# Altium project FFD.PrjPcb
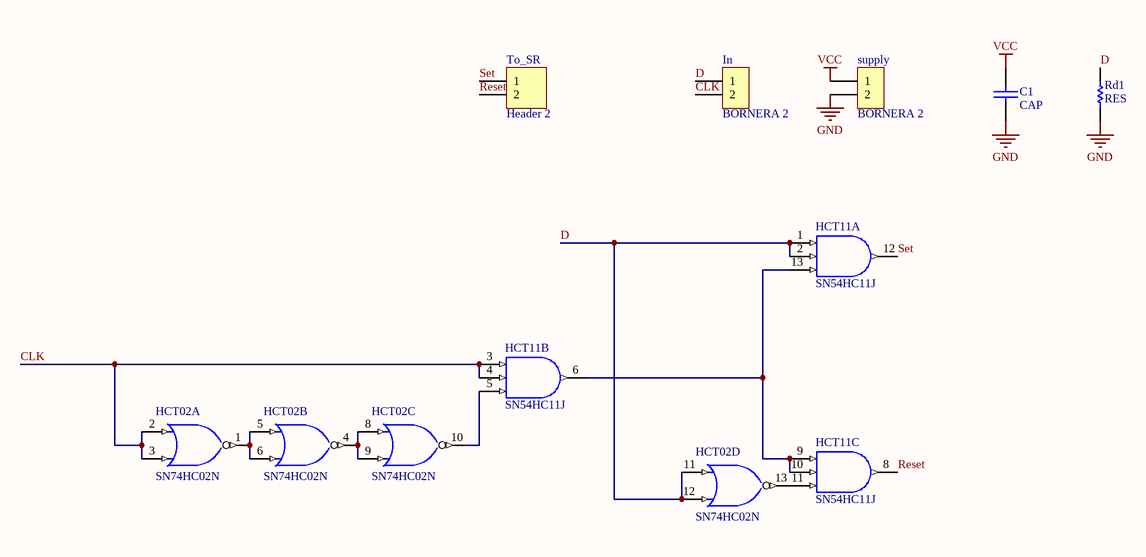
[diagram p0: FFD.SchDoc]
1 sheet, 7 parts. Net scope: global (net labels, ports and power ports of the same name join across sheets).
Board file: FFD.PcbDoc

## Sheet FFD.SchDoc
size A4

### Parts
C1  CAP  [CAP100]
HCT02  SN74HC02N  [N014]  (parts A,B,C,D of 4)
HCT11  SN54HC11J  [J014]  (parts A,B,C of 3)
In  BORNERA 2  [BORNERA2]
Rd1  RES  [0805]
supply  BORNERA 2  [BORNERA2]
To_SR  Header 2  [HDR1X2]

### Nets
GND: C1.2 HCT02.7(GND) HCT11.7(GND) Rd1.1 supply.2
VCC: C1.1 HCT02.14(VCC) HCT11.14(VCC) supply.1
CLK: HCT02.2(A) HCT02.3(B) HCT11.3(A) HCT11.4(B) In.2
D: HCT02.11(A) HCT02.12(B) HCT11.1(A) HCT11.2(B) In.1 Rd1.2
Reset: HCT11.8(Y) To_SR.2
Set: HCT11.12(Y) To_SR.1
NetHCT02_1: HCT02.1(Y) HCT02.5(A) HCT02.6(B)
NetHCT02_4: HCT02.4(Y) HCT02.8(A) HCT02.9(B)
NetHCT02_10: HCT02.10(Y) HCT11.5(C)
NetHCT02_13: HCT02.13(Y) HCT11.11(C)
NetHCT11_6: HCT11.6(Y) HCT11.9(A) HCT11.10(B) HCT11.13(C)

### Library data of the parts
HCT02 = SN74HC02N: Quadruple 2-Input Positive-NOR Gate; Published: 8-Jun-2000; LatestRevisionDate: 04-Mar-2005; LatestRevisionNote: Stylized 3D Model Added.; DatasheetVersion: May-1997; PackageVersion: Oct-1995; PackageReference: N014; Publisher: Altium Limited; PackageDescription: DIP; 14 Leads; Row Spacing 7.62 mm; Pitch 2.54 mm; ComponentLink1Description: Manufacturer Link; ComponentLink1URL: http://www.ti.com/; ComponentLink2Description: Datasheet; ComponentLink2URL: http://www-s.ti.com/sc/ds/sn74hc02.pdf
HCT11 = SN54HC11J: Triple 3-Input Positive-AND Gate; Published: 8-Jun-2000; LatestRevisionDate: 04-Mar-2005; LatestRevisionNote: Stylized 3D Model Added.; DatasheetVersion: May-1997; PackageVersion: Jun-1999; PackageReference: J014; Publisher: Altium Limited; PackageDescription: DIP; 14 Leads; Row Spacing 7.62 mm; Pitch 2.54 mm; ComponentLink1Description: Manufacturer Link; ComponentLink1URL: http://www.ti.com/; ComponentLink2Description: Datasheet; ComponentLink2URL: http://www-s.ti.com/sc/ds/sn54hc11.pdf; ComponentLink3Description: Packaging Specification; ComponentLink3URL: http://focus.ti.com/lit/ml/mcer002d/mcer002d.pdf
To_SR = Header 2: Header, 2-Pin; LatestRevisionDate: 17-Jul-2002; LatestRevisionNote: Re-released for DXP Platform.; Publisher: Altium Limited